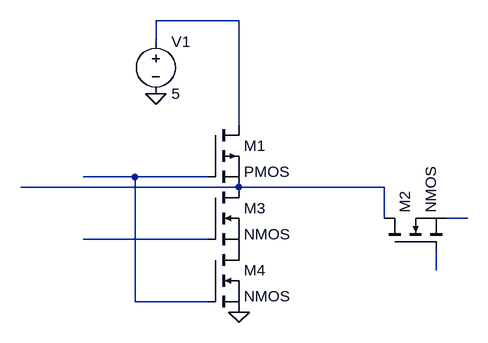
[diagram p0: schematic Draft1.asc]
Draft1.asc, the LTspice schematic file:
Version 4
SHEET 1 880 680
WIRE 160 -112 32 -112
WIRE 32 -80 32 -112
WIRE 160 48 160 -112
WIRE 0 128 -80 128
WIRE 112 128 0 128
WIRE 160 144 -176 144
WIRE 384 144 160 144
WIRE 384 192 384 144
WIRE 512 192 480 192
WIRE 112 224 -80 224
WIRE 464 272 464 240
WIRE 0 320 0 128
WIRE 112 320 0 320
FLAG 160 336 0
FLAG 32 0 0
SYMBOL pmos 112 48 R0
SYMATTR InstName M1
SYMBOL nmos 112 144 R0
SYMATTR InstName M3
SYMBOL nmos 112 240 R0
SYMATTR InstName M4
SYMBOL voltage 32 -96 R0
SYMATTR InstName V1
SYMATTR Value 5
SYMBOL nmos 384 240 R270
SYMATTR InstName M2

The netlist it stands for:
* Draft1.asc
M1 N001 N002 N003 N003 PMOS
M3 N003 N005 P001 P001 NMOS
M4 P001 N002 0 0 NMOS
V1 N001 0 5
M2 N003 N006 N004 N004 NMOS
.model NMOS NMOS
.model PMOS PMOS
.lib standard.mos
.backanno
.end